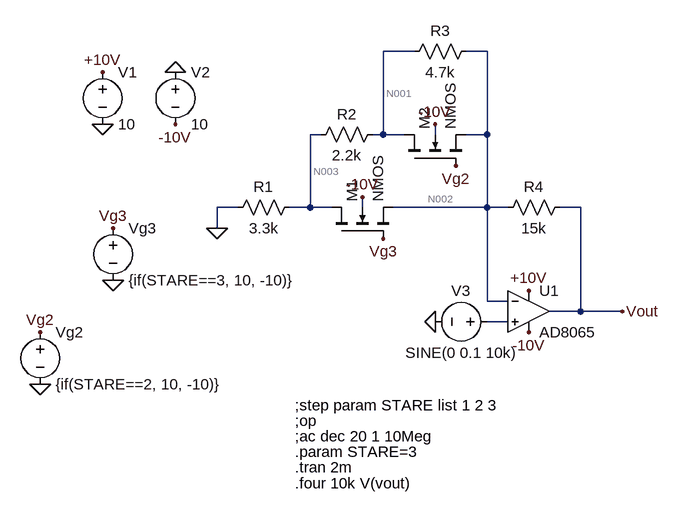
[diagram p0: schematic Etaj3.asc]
Etaj3.asc, the LTspice schematic file:
Version 4.1
SHEET 1 880 680
WIRE 352 -80 304 -80
WIRE 464 -80 432 -80
WIRE 208 48 192 48
WIRE 304 48 304 -80
WIRE 304 48 288 48
WIRE 336 48 304 48
WIRE 384 48 384 32
WIRE 464 48 464 -80
WIRE 464 48 432 48
WIRE 80 160 48 160
WIRE 192 160 192 48
WIRE 192 160 160 160
WIRE 224 160 192 160
WIRE 272 160 272 144
WIRE 464 160 464 48
WIRE 464 160 320 160
WIRE 496 160 464 160
WIRE 608 160 576 160
WIRE 48 192 48 160
WIRE 464 304 464 160
WIRE 496 304 464 304
WIRE 608 320 608 160
WIRE 608 320 560 320
WIRE 672 320 608 320
WIRE 496 336 464 336
FLAG 48 192 0
FLAG 672 320 Vout
FLAG 528 288 +10V
FLAG -128 -48 +10V
FLAG 528 352 -10V
FLAG 272 144 -10V
FLAG 384 32 -10V
FLAG -16 32 -10V
FLAG -16 -48 0
FLAG -128 32 0
FLAG 384 336 0
FLAG -224 432 0
FLAG -112 272 0
FLAG -224 352 Vg2
FLAG 416 96 Vg2
FLAG -112 192 Vg3
FLAG 304 208 Vg3
SYMBOL res 176 144 R90
WINDOW 0 0 56 VBottom 2
WINDOW 3 32 56 VTop 2
SYMATTR InstName R1
SYMATTR Value 3.3k
SYMBOL nmos4 224 208 R270
SYMATTR InstName M1
SYMATTR Value2 l=1u w=10m
SYMBOL res 304 32 R90
WINDOW 0 0 56 VBottom 2
WINDOW 3 32 56 VTop 2
SYMATTR InstName R2
SYMATTR Value 2.2k
SYMBOL res 448 -96 R90
WINDOW 0 0 56 VBottom 2
WINDOW 3 32 56 VTop 2
SYMATTR InstName R3
SYMATTR Value 4.7k
SYMBOL nmos4 336 96 R270
SYMATTR InstName M2
SYMATTR Value2 l=1u w=10m
SYMBOL res 592 144 R90
WINDOW 0 0 56 VBottom 2
WINDOW 3 32 56 VTop 2
SYMATTR InstName R4
SYMATTR Value 15k
SYMBOL OpAmps\\AD8065 528 256 R0
SYMATTR InstName U1
SYMBOL voltage -128 -64 R0
WINDOW 123 0 0 Left 0
WINDOW 39 0 0 Left 0
SYMATTR InstName V1
SYMATTR Value 10
SYMBOL voltage -16 -64 R0
WINDOW 123 0 0 Left 0
WINDOW 39 0 0 Left 0
SYMATTR InstName V2
SYMATTR Value 10
SYMBOL voltage -224 336 R0
WINDOW 123 0 0 Left 0
WINDOW 39 0 0 Left 0
SYMATTR InstName Vg2
SYMATTR Value {if(STARE==2, 10, -10)}
SYMBOL voltage -112 176 R0
WINDOW 123 0 0 Left 0
WINDOW 39 0 0 Left 0
SYMATTR InstName Vg3
SYMATTR Value {if(STARE==3, 10, -10)}
SYMBOL voltage 480 336 R90
WINDOW 0 -32 56 VBottom 2
WINDOW 3 32 56 VTop 2
WINDOW 123 60 56 VTop 2
WINDOW 39 0 0 Left 0
SYMATTR InstName V3
SYMATTR Value SINE(0 0.1 10k)
TEXT 168 464 Left 2 !;step param STARE list 1 2 3
TEXT 168 488 Left 2 !;op
TEXT 168 512 Left 2 !;ac dec 20 1 10Meg
TEXT 168 536 Left 2 !.param STARE=3
TEXT 168 560 Left 2 !.tran 2m
TEXT 168 584 Left 2 !.four 10k V(vout)

The netlist it stands for:
* Etaj3.asc
R1 N003 0 3.3k
M1 N003 Vg3 N002 -10V NMOS l=1u w=10m
R2 N001 N003 2.2k
R3 N002 N001 4.7k
M2 N001 Vg2 N002 -10V NMOS l=1u w=10m
R4 Vout N002 15k
X§U1 N004 N002 +10V -10V Vout AD8065  ; pins In+ In- V+ V- OUT
V1 +10V 0 10
V2 0 -10V 10
Vg2 Vg2 0 {if(STARE==2, 10, -10)}
Vg3 Vg3 0 {if(STARE==3, 10, -10)}
V3 N004 0 SINE(0 0.1 10k)
.model NMOS NMOS
.model PMOS PMOS
.lib standard.mos
;step param STARE list 1 2 3
;op
;ac dec 20 1 10Meg
.param STARE=3
.tran 2m
.four 10k V(vout)
.backanno
.end

* Results of the author's LTspice run, read from the files saved beside the schematic
* Operating Point, zero values left out:
*   V(vg3) = 10 V
*   V(-10v) = -10 V
*   V(n001) = 399.9 µV
*   V(vout) = 2.218 mV
*   V(n003) = 399.9 µV
*   V(n002) = 400 µV
*   V(vg2) = -10 V
*   V(+10v) = 10 V
*   I(R2) = 1.964 pA
*   I(R4) = 121.2 nA
*   I(R1) = 121.2 nA
*   Id(M2) = 10.01 pA
*   Is(M2) = 10.01 pA
*   Ib(M2) = -20.02 pA
*   I(V2) = -6.4 mA
*   I(V3) = -2 pA
*   Id(M1) = -121.2 nA
*   Is(M1) = 121.2 nA
*   Ib(M1) = -20.02 pA
*   I(R3) = 11.97 pA
*   I(V1) = -6.4 mA
*   Ix(u1:1) = 2 pA
*   Ix(u1:2) = 1.001 pA
*   Ix(u1:3) = 6.4 mA
*   Ix(u1:4) = -6.4 mA
*   Ix(u1:5) = -121.2 nA
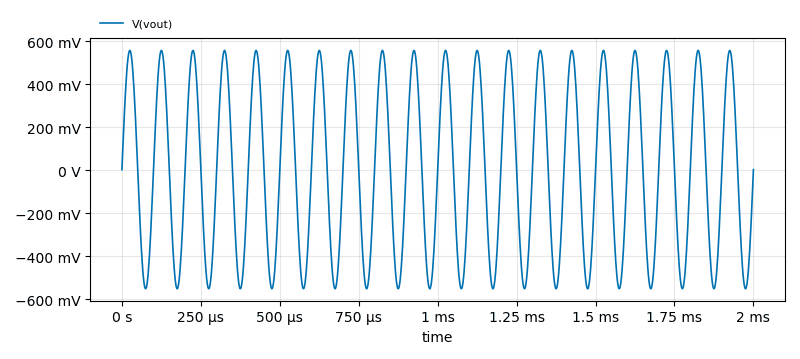
[diagram p1: Transient Analysis of Etaj3.asc, plotted from the saved traces]
* Transient Analysis, 1 run:
*   V(vout): min -552.3 mV, max 556.7 mV, average 2.218 mV, rms 392.1 mV, last 1.96 mV
* From the log:
*   Fourier components of V(vout)
*   N-Period=1
*   DC component:0.00221414
*   Harmonic  Frequency   Fourier   Normalized   Phase    Normalized
*    Number     [Hz]     Component   Component  [degree]  Phase [deg]
*       1      1.000e+04   5.538e-01   1.000e+00     90.03°      0.00°
*       2      2.000e+04   8.960e-06   1.618e-05      5.31°    -84.72°
*       3      3.000e+04   8.357e-06   1.509e-05    -79.33°   -169.35°
*       4      4.000e+04   7.999e-06   1.444e-05   -168.07°   -258.10°
*       5      5.000e+04   8.212e-06   1.483e-05    102.22°     12.19°
*       6      6.000e+04   8.586e-06   1.550e-05     16.52°    -73.51°
*       7      7.000e+04   8.394e-06   1.516e-05    -67.94°   -157.97°
*       8      8.000e+04   7.983e-06   1.442e-05   -156.13°   -246.16°
*       9      9.000e+04   8.114e-06   1.465e-05    113.81°     23.78°
*   Partial Harmonic Distortion: 0.004255%
*   Total Harmonic Distortion:   0.056126%